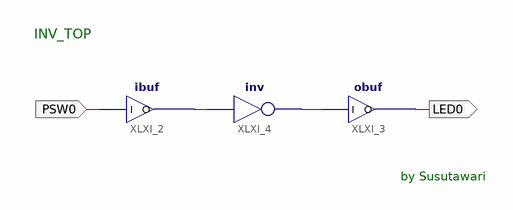
[diagram p0: schematic sheet 1]
// Xilinx ISE schematic INV_TOP.sch (spartan3e) as structural Verilog: 3 symbols, 2 ports
module INV_TOP (
  input  PSW0,
  output LED0
);

  wire XLXN_4, XLXN_5;

  ibuf XLXI_2 (.I(PSW0), .O(XLXN_4));
  obuf XLXI_3 (.I(XLXN_5), .O(LED0));
  not XLXI_4 (XLXN_5, XLXN_4);

  // Notes on the sheet:
  //   INV_TOP
  //   by Susutawari
endmodule
